# EAGLE schematic Ex Controller ExPwr (EAGLE 7.4.0)
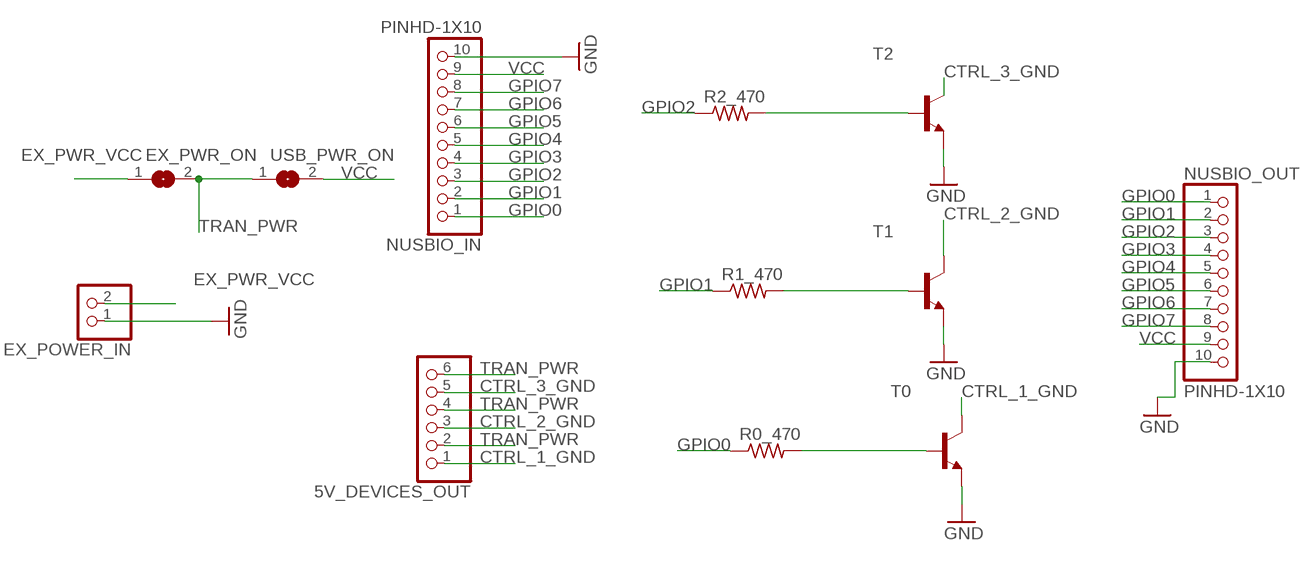
[diagram p0: schematic, sheet 1]

## Parts
5V_DEVICES_OUT  PINHD-1X6  [1X06]
EX_POWER_IN  PINHD-1X2  [1X02]
EX_PWR_ON  SOLDERJUMPERREFLOW  [SOLDERJUMPER_REFLOW]
NUSBIO_IN  PINHD-1X10  [1X10-BIG]
NUSBIO_OUT  PINHD-1X10  [1X10-BIG]
R0_470  R-US_R0805  [R0805]
R1_470  R-US_R0805  [R0805]
R2_470  R-US_R0805  [R0805]
T0  MMBT3904LT1-NPN-SOT23-BEC  [SOT23-BEC]
T1  MMBT3904LT1-NPN-SOT23-BEC  [SOT23-BEC]
T2  MMBT3904LT1-NPN-SOT23-BEC  [SOT23-BEC]
USB_PWR_ON  SOLDERJUMPERREFLOW  [SOLDERJUMPER_REFLOW]

## Nets
CTRL_1_GND: 5V_DEVICES_OUT.1 T0.C
CTRL_2_GND: 5V_DEVICES_OUT.3 T1.C
CTRL_3_GND: 5V_DEVICES_OUT.5 T2.C
EX_PWR_VCC: EX_POWER_IN.2 EX_PWR_ON.1
GND: EX_POWER_IN.1 NUSBIO_IN.10 NUSBIO_OUT.10 T0.E T1.E T2.E
GPIO0: NUSBIO_IN.1 NUSBIO_OUT.1 R0_470.1
GPIO1: NUSBIO_IN.2 NUSBIO_OUT.2 R1_470.1
GPIO2: NUSBIO_IN.3 NUSBIO_OUT.3 R2_470.1
GPIO3: NUSBIO_IN.4 NUSBIO_OUT.4
GPIO4: NUSBIO_IN.5 NUSBIO_OUT.5
GPIO5: NUSBIO_IN.6 NUSBIO_OUT.6
GPIO6: NUSBIO_IN.7 NUSBIO_OUT.7
GPIO7: NUSBIO_IN.8 NUSBIO_OUT.8
N$1: R2_470.2 T2.B
N$2: R0_470.2 T0.B
N$3: R1_470.2 T1.B
TRAN_PWR: 5V_DEVICES_OUT.2 5V_DEVICES_OUT.4 5V_DEVICES_OUT.6 EX_PWR_ON.2 USB_PWR_ON.1
VCC: NUSBIO_IN.9 NUSBIO_OUT.9 USB_PWR_ON.2

## Library data of the parts
5V_DEVICES_OUT = adafruit:PINHD-1X6: PIN HEADER
EX_POWER_IN = pinhead:PINHD-1X2: PIN HEADER
EX_PWR_ON USB_PWR_ON = microbuilder:SOLDERJUMPER: SMD Solder JUMPER Solder the two pads together to create a connection, or remove the solder to break it. REFLOW - Use this footprint for solder paste and reflow ovens. WAVE - Use this footprint for hand-soldering (larger pads). CLOSED - Has a trace between the two pads to ensure it is closed by default. The trace needs to be cut to disable the jumper, and can be closed again by creating a solder bridge between the two pads.
NUSBIO_IN NUSBIO_OUT = adafruit:PINHD-1X10: Pin header 1x10 0.1" spacing With round pins
R0_470 R1_470 R2_470 = adafruit:R-US_: RESISTOR, American symbol
T0 T1 T2 = transistor:*-NPN-: NPN Transistror BF959 corrected 2008.03.06